# EAGLE design bi-n-tic-kscgs (EAGLE 6.6.0)
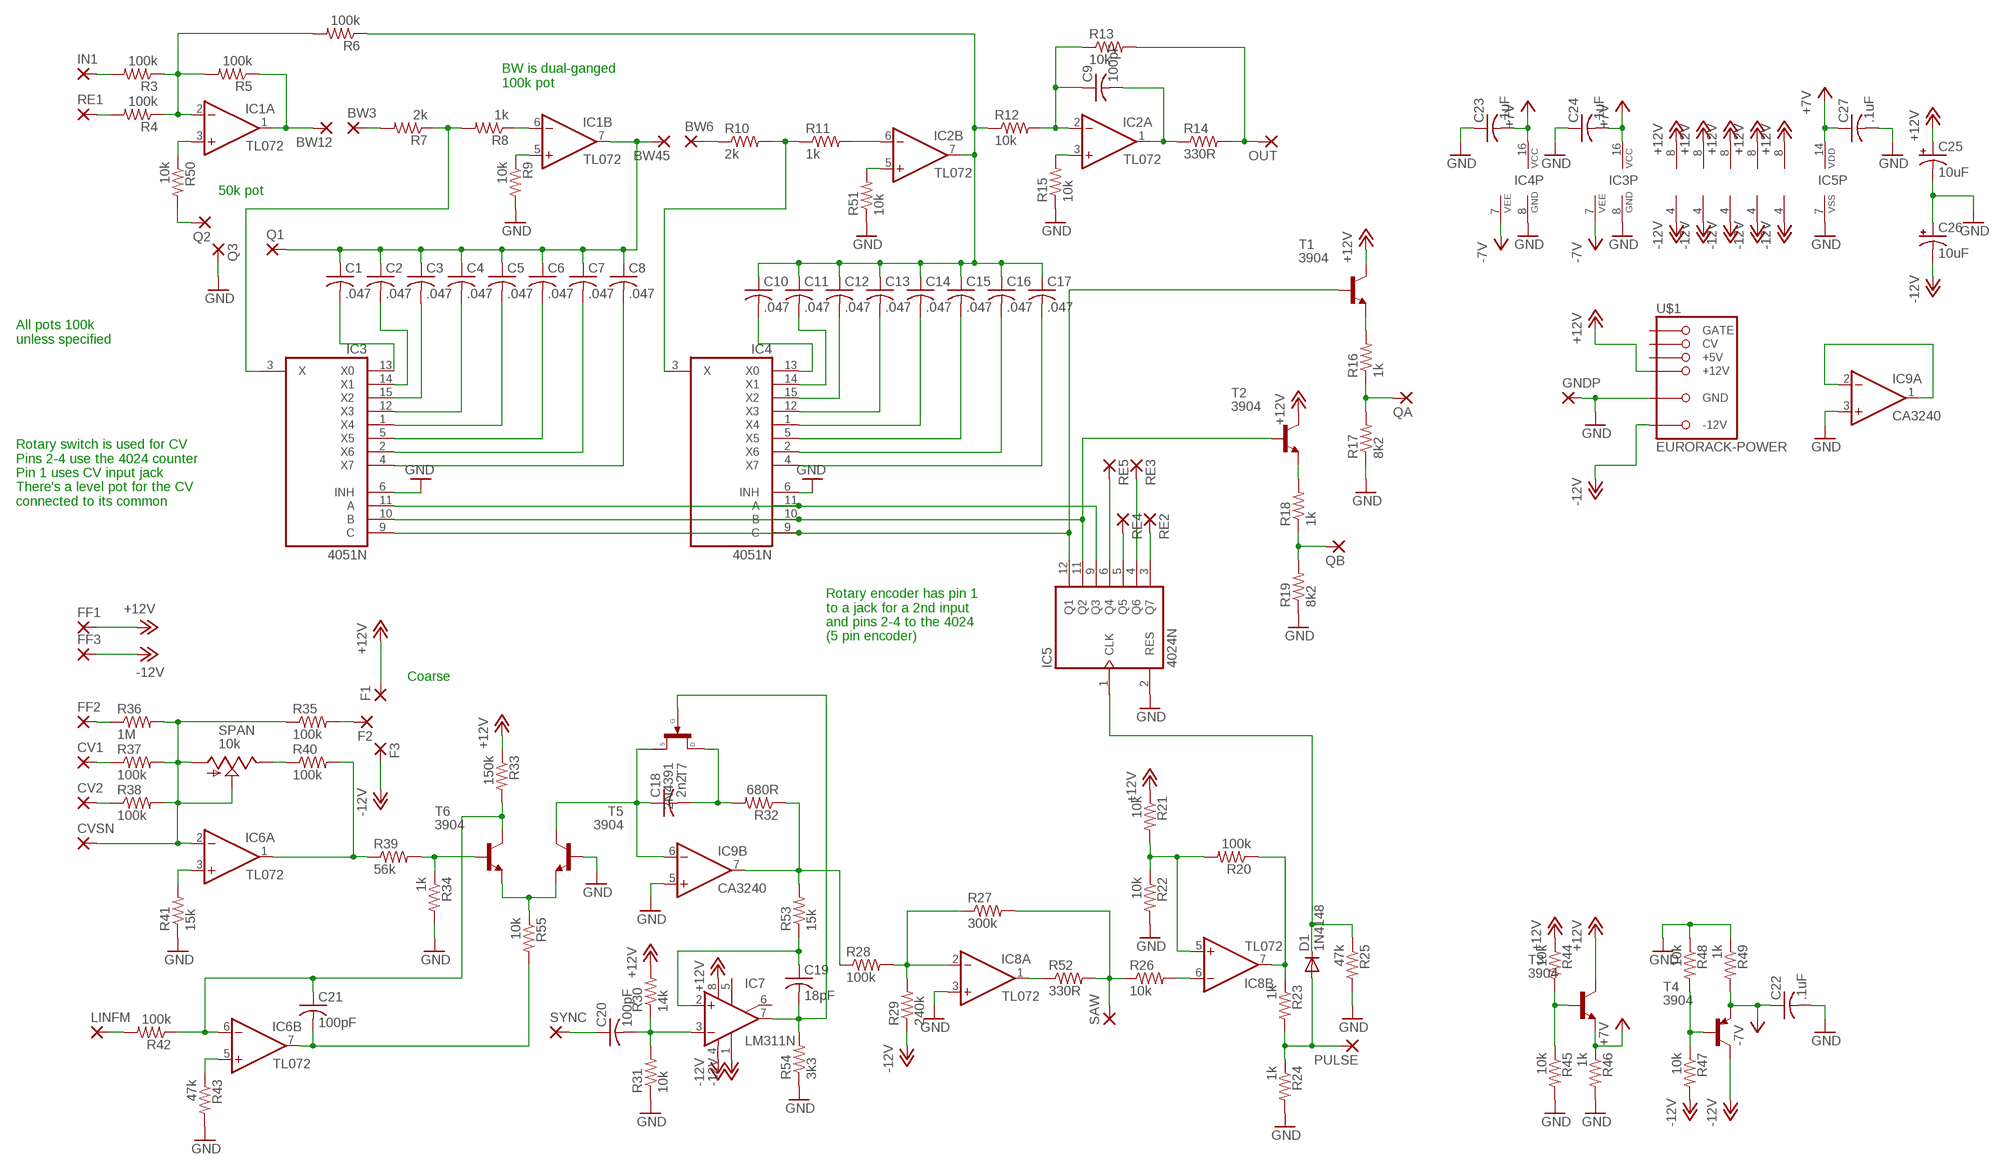
[diagram p0: schematic, sheet 1]

## Parts
BW3  2,54/1,0  [2,54/1,0]
BW6  2,54/1,0  [2,54/1,0]
BW12  2,54/1,0  [2,54/1,0]
BW45  2,54/1,0  [2,54/1,0]
C1  .047  C-US050-025X075  [C050-025X075]
C2  .047  C-US050-025X075  [C050-025X075]
C3  .047  C-US050-025X075  [C050-025X075]
C4  .047  C-US050-025X075  [C050-025X075]
C5  .047  C-US050-025X075  [C050-025X075]
C6  .047  C-US050-025X075  [C050-025X075]
C7  .047  C-US050-025X075  [C050-025X075]
C8  .047  C-US050-025X075  [C050-025X075]
C9  100pF  C-US050-025X075  [C050-025X075]
C10  .047  C-US050-025X075  [C050-025X075]
C11  .047  C-US050-025X075  [C050-025X075]
C12  .047  C-US050-025X075  [C050-025X075]
C13  .047  C-US050-025X075  [C050-025X075]
C14  .047  C-US050-025X075  [C050-025X075]
C15  .047  C-US050-025X075  [C050-025X075]
C16  .047  C-US050-025X075  [C050-025X075]
C17  .047  C-US050-025X075  [C050-025X075]
C18  2n2  C-US050-025X075  [C050-025X075]
C19  18pF  C-US050-025X075  [C050-025X075]
C20  100pF  C-US050-025X075  [C050-025X075]
C21  100pF  C-US050-025X075  [C050-025X075]
C22  .1uF  C-US050-025X075  [C050-025X075]
C23  .1uF  C-US050-025X075  [C050-025X075]
C24  .1uF  C-US050-025X075  [C050-025X075]
C25  10uF  CPOL-USE2.5-5  [E2,5-5]
C26  10uF  CPOL-USE2.5-5  [E2,5-5]
C27  .1uF  C-US050-025X075  [C050-025X075]
CV1  2,54/1,0  [2,54/1,0]
CV2  2,54/1,0  [2,54/1,0]
CVSN  2,54/1,0  [2,54/1,0]
D1  1N4148  1N4148DO35-7  [DO35-7]
F1  2,54/1,0  [2,54/1,0]
F2  2,54/1,0  [2,54/1,0]
F3  2,54/1,0  [2,54/1,0]
FF1  2,54/1,0  [2,54/1,0]
FF2  2,54/1,0  [2,54/1,0]
FF3  2,54/1,0  [2,54/1,0]
GNDP  2,54/1,0  [2,54/1,0]
IC1  TL072  TL072-TOPP  [DIL08]
IC2  TL072  TL072-TOPP  [DIL08]
IC3  4051N  [DIL16]
IC4  4051N  [DIL16]
IC5  4024N  [DIL14]
IC6  TL072  TL072-TOPP  [DIL08]
IC7  LM311N  [DIL08]
IC8  TL072  TL072-TOPP  [DIL08]
IC9  CA3240  TL072-TOPP  [DIL08]
IN1  2,54/1,0  [2,54/1,0]
LINFM  2,54/1,0  [2,54/1,0]
OUT  2,54/1,0  [2,54/1,0]
PULSE  2,54/1,0  [2,54/1,0]
Q1  2,54/1,0  [2,54/1,0]
Q2  2,54/1,0  [2,54/1,0]
Q3  2,54/1,0  [2,54/1,0]
QA  2,54/1,0  [2,54/1,0]
QB  2,54/1,0  [2,54/1,0]
R3  100k  R-US_0207/10  [0207/10]
R4  100k  R-US_0207/10  [0207/10]
R5  100k  R-US_0207/10  [0207/10]
R6  100k  R-US_0207/10  [0207/10]
R7  2k  R-US_0207/10  [0207/10]
R8  1k  R-US_0207/10  [0207/10]
R9  10k  R-US_0207/10  [0207/10]
R10  2k  R-US_0207/10  [0207/10]
R11  1k  R-US_0207/10  [0207/10]
R12  10k  R-US_0207/10  [0207/10]
R13  10k  R-US_0207/10  [0207/10]
R14  330R  R-US_0207/10  [0207/10]
R15  10k  R-US_0207/10  [0207/10]
R16  1k  R-US_0207/10  [0207/10]
R17  8k2  R-US_0207/10  [0207/10]
R18  1k  R-US_0207/10  [0207/10]
R19  8k2  R-US_0207/10  [0207/10]
R20  100k  R-US_0207/10  [0207/10]
R21  10k  R-US_0207/10  [0207/10]
R22  10k  R-US_0207/10  [0207/10]
R23  1k  R-US_0207/10  [0207/10]
R24  1k  R-US_0207/10  [0207/10]
R25  47k  R-US_0207/10  [0207/10]
R26  10k  R-US_0207/10  [0207/10]
R27  300k  R-US_0207/10  [0207/10]
R28  100k  R-US_0207/10  [0207/10]
R29  240k  R-US_0207/10  [0207/10]
R30  14k  R-US_0207/10  [0207/10]
R31  10k  R-US_0207/10  [0207/10]
R32  680R  R-US_0207/10  [0207/10]
R33  150k  R-US_0207/10  [0207/10]
R34  1k  R-US_0207/10  [0207/10]
R35  100k  R-US_0207/10  [0207/10]
R36  1M  R-US_0207/10  [0207/10]
R37  100k  R-US_0207/10  [0207/10]
R38  100k  R-US_0207/10  [0207/10]
R39  56k  R-US_0207/10  [0207/10]
R40  100k  R-US_0207/10  [0207/10]
R41  15k  R-US_0207/10  [0207/10]
R42  100k  R-US_0207/10  [0207/10]
R43  47k  R-US_0207/10  [0207/10]
R44  10k  R-US_0207/10  [0207/10]
R45  10k  R-US_0207/10  [0207/10]
R46  1k  R-US_0207/10  [0207/10]
R47  10k  R-US_0207/10  [0207/10]
R48  10k  R-US_0207/10  [0207/10]
R49  1k  R-US_0207/10  [0207/10]
R50  10k  R-US_0207/10  [0207/10]
R51  10k  R-US_0207/10  [0207/10]
R52  330R  R-US_0207/10  [0207/10]
R53  15k  R-US_0207/10  [0207/10]
R54  3k3  R-US_0207/10  [0207/10]
R55  10k  R-US_0207/10  [0207/10]
RE1  2,54/1,0  [2,54/1,0]
RE2  2,54/1,0  [2,54/1,0]
RE3  2,54/1,0  [2,54/1,0]
RE4  2,54/1,0  [2,54/1,0]
RE5  2,54/1,0  [2,54/1,0]
SAW  2,54/1,0  [2,54/1,0]
SPAN  10k  TRIM_US-RJ9W  [RJ9W]
SYNC  2,54/1,0  [2,54/1,0]
T1  3904  2N3904-NPN-TO92-EBC  [TO92-EBC]
T2  3904  2N3904-NPN-TO92-EBC  [TO92-EBC]
T3  3904  2N3904-NPN-TO92-EBC  [TO92-EBC]
T4  3904  2N3906-PNP-TO92-EBC  [TO92-EBC]
T5  3904  2N3904-NPN-TO92-EBC  [TO92-EBC]
T6  3904  2N3904-NPN-TO92-EBC  [TO92-EBC]
T7  2N4391  [TO18E]
U$1  EURORACK-POWER  [PINSHRD_PTH_2X8]

## Nets
+7V: C23.2 C24.2 C27.1 IC3.16(VCC) IC4.16(VCC) IC5.14(VDD) R46.1 T3.E
+12V: C25.+ F1.1(P) FF1.1(P) IC1.8(P:V+) IC2.8(P:V+) IC6.8(P:V+) IC7.8(V+) IC8.8(P:V+) IC9.8(P:V+) R21.1 R30.2 R33.1 R44.1 T1.C T2.C T3.C U$1.+12V@1(+12V) U$1.+12V@2(+12V)
-7V: C22.1 IC3.7(VEE) IC4.7(VEE) R49.2 T4.E
-12V: C26.- F3.1(P) FF3.1(P) IC1.4(P:V-) IC2.4(P:V-) IC6.4(P:V-) IC7.1(GND) IC7.4(V-) IC8.4(P:V-) IC9.4(P:V-) R29.1 R47.2 T4.C U$1.-12V@1(-12V) U$1.-12V@2(-12V)
GND: C22.2 C23.1 C24.1 C25.- C26.+ C27.2 GNDP.1(P) IC3.6(INH) IC3.8(GND) IC4.6(INH) IC4.8(GND) IC5.2(RES) IC5.7(VSS) IC8.3(A:+IN) IC9.3(A:+IN) IC9.5(B:+IN) Q3.1(P) R9.2 R15.1 R17.1 R19.1 R22.2 R24.2 R25.2 R31.1 R34.2 R41.1 R43.2 R45.2 R46.2 R48.1 R49.1 R51.1 R54.1 T5.B U$1.GND@1(GND) U$1.GND@2(GND) U$1.GND@3(GND) U$1.GND@4(GND) U$1.GND@5(GND) U$1.GND@6(GND)
N$1: IC8.2(A:-IN) R27.1 R28.2 R29.2
N$2: IC1.2(A:-IN) R3.1 R4.1 R5.2 R6.2
N$3: BW12.1(P) IC1.1(A:OUT) R5.1
N$4: IC1.3(A:+IN) R50.1
N$5: Q2.1(P) R50.2
N$6: BW3.1(P) R7.2
N$7: IC3.3(X) R7.1 R8.2
N$8: IC1.6(B:-IN) R8.1
N$9: C1.2 IC3.13(X0)
N$10: C2.2 IC3.14(X1)
N$11: C3.2 IC3.15(X2)
N$12: C4.2 IC3.12(X3)
N$13: C5.2 IC3.1(X4)
N$14: C6.2 IC3.5(X5)
N$15: C7.2 IC3.2(X6)
N$16: C8.2 IC3.4(X7)
N$17: BW45.1(P) C1.1 C2.1 C3.1 C4.1 C5.1 C6.1 C7.1 C8.1 IC1.7(B:OUT) Q1.1(P)
N$18: BW6.1(P) R10.1
N$19: IC4.3(X) R10.2 R11.1
N$20: IC2.6(B:-IN) R11.2
N$21: C10.1 C11.1 C12.1 C13.1 C14.1 C15.1 C16.1 C17.1 IC2.7(B:OUT) R6.1 R12.1
N$22: C9.1 IC2.2(A:-IN) R12.2 R13.1
N$23: C9.2 IC2.1(A:OUT) R14.1
N$24: OUT.1(P) R13.2 R14.2
N$25: IC2.3(A:+IN) R15.2
N$26: IC1.5(B:+IN) R9.1
N$27: C10.2 IC4.13(X0)
N$28: C11.2 IC4.14(X1)
N$29: C12.2 IC4.15(X2)
N$30: C13.2 IC4.12(X3)
N$31: C14.2 IC4.1(X4)
N$32: C15.2 IC4.5(X5)
N$33: C16.2 IC4.2(X6)
N$34: C17.2 IC4.4(X7)
N$35: IC2.5(B:+IN) R51.2
N$36: R16.2 T1.E
N$37: FF2.1(P) R36.1
N$38: CV1.1(P) R37.1
N$39: CV2.1(P) R38.1
N$40: LINFM.1(P) R42.2
N$41: QA.1(P) R16.1 R17.2
N$42: IC3.10(B) IC4.10(B) IC5.11(Q2) T2.B
N$43: IC3.9(C) IC4.9(C) IC5.12(Q1) T1.B
N$44: IC3.11(A) IC4.11(A) IC5.9(Q3)
N$45: R18.2 T2.E
N$46: QB.1(P) R18.1 R19.2
N$47: D1.C IC5.1(CLK) R25.1
N$48: IC9.7(B:OUT) R28.1 R32.1 R53.2
N$49: IC8.5(B:+IN) R20.2 R21.2 R22.1
N$50: IC8.7(B:OUT) R20.1 R23.1
N$51: D1.A PULSE.1(P) R23.2 R24.1
N$52: IC8.6(B:-IN) R26.2
N$53: R26.1 R27.2 R52.2 SAW.1(P)
N$54: IC8.1(A:OUT) R52.1
N$55: C19.2 IC7.7(OUT) R54.2 T7.G
N$56: C18.1 IC9.6(B:-IN) T5.C T7.S
N$57: C18.2 R32.2 T7.D
N$58: C19.1 IC7.2(+IN) R53.1
N$59: C20.2 IC7.3(-IN) R30.1 R31.2
N$60: C20.1 SYNC.1(P)
N$61: IC9.1(A:OUT) IC9.2(A:-IN)
N$62: IC6.5(B:+IN) R43.1
N$63: C21.2 IC6.7(B:OUT) R55.2
N$64: C21.1 IC6.6(B:-IN) R33.2 R42.1 T6.C
N$65: IC6.3(A:+IN) R41.2
N$66: R44.2 R45.1 T3.B
N$67: CVSN.1(P) IC6.2(A:-IN) R35.1 R36.2 R37.2 R38.2 SPAN.A SPAN.S
N$68: R40.1 SPAN.E
N$69: IC6.1(A:OUT) R39.1 R40.2
N$70: F2.1(P) R35.2
N$71: R34.1 R39.2 T6.B
N$72: IN1.1(P) R3.2
N$73: R55.1 T5.E T6.E
N$74: R47.1 R48.2 T4.B
N$75: R4.2 RE1.1(P)
N$76: IC5.6(Q4) RE5.1(P)
N$77: IC5.5(Q5) RE4.1(P)
N$79: IC5.3(Q7) RE2.1(P)
RE3: IC5.4(Q6) RE3.1(P)
Unconnected: IC7.5(ON) IC7.6(ON/STR) U$1.+5V@1(+5V) U$1.+5V@2(+5V) U$1.CV@1(CV) U$1.CV@2(CV) U$1.GATE@1(GATE) U$1.GATE@2(GATE)

## Notes on the sheet
- BW is dual-ganged
  100k pot
- 50k pot
- All pots 100k
  unless specified
- Rotary switch is used for CV
  Pins 2-4 use the 4024 counter
  Pin 1 uses CV input jack
  There's a level pot for the CV
  connected to its common
- Rotary encoder has pin 1
  to a jack for a 2nd input
  and pins 2-4 to the 4024
  (5 pin encoder)
- Coarse

## Library data of the parts
BW3 BW6 BW12 BW45 CV1 CV2 CVSN F1-F3 FF1-FF3 GNDP IN1 LINFM OUT PULSE Q1-Q3 QA QB RE1-RE5 SAW SYNC = wirepad:2,54/1,0: THROUGH-HOLE PAD
C1-C24 C27 = rcl:C-US: CAPACITOR, American symbol
C25 C26 = rcl:CPOL-US: POLARIZED CAPACITOR, American symbol
D1 = diode:1N4148: DIODE high speed (Philips)
IC1 IC2 IC6 IC8 IC9 = mmoretti:TL072-TOP: OP AMP
IC3 IC4 = 40xx:4051: 8-channel ANALOG MULTIPLEXER
IC5 = 40xx:4024: 7-stage binary/ripple COUNTER
IC7 = linear:LM311: COMPARATOR
R3-R55 = rcl:R-US_: RESISTOR, American symbol
SPAN = pot:TRIM_US-: POTENTIOMETER
T1-T3 T5 T6 = transistor-neu-to92:*-NPN-: NPN Transistror
T4 = transistor-neu-to92:*-PNP-: PNP Transistror
T7 = mmoretti:2N4391: N-CHANNEL FET
U$1 = mmoretti:EURORACK-POWER

## Board
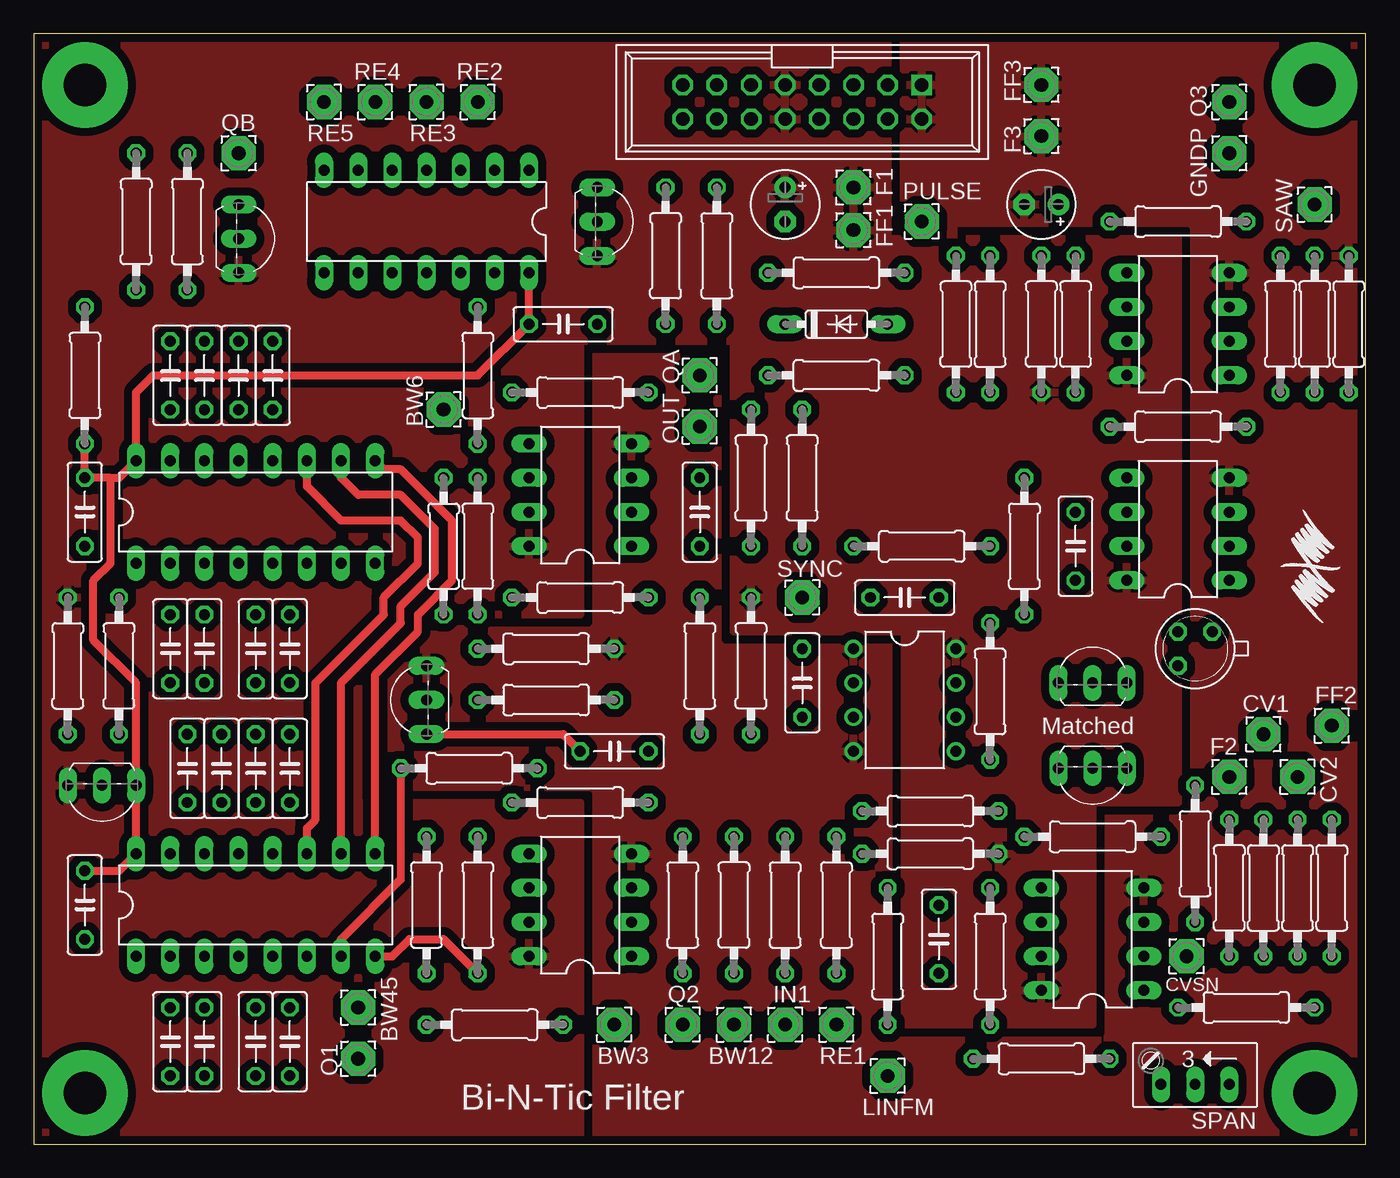
[diagram p1: board, top side]
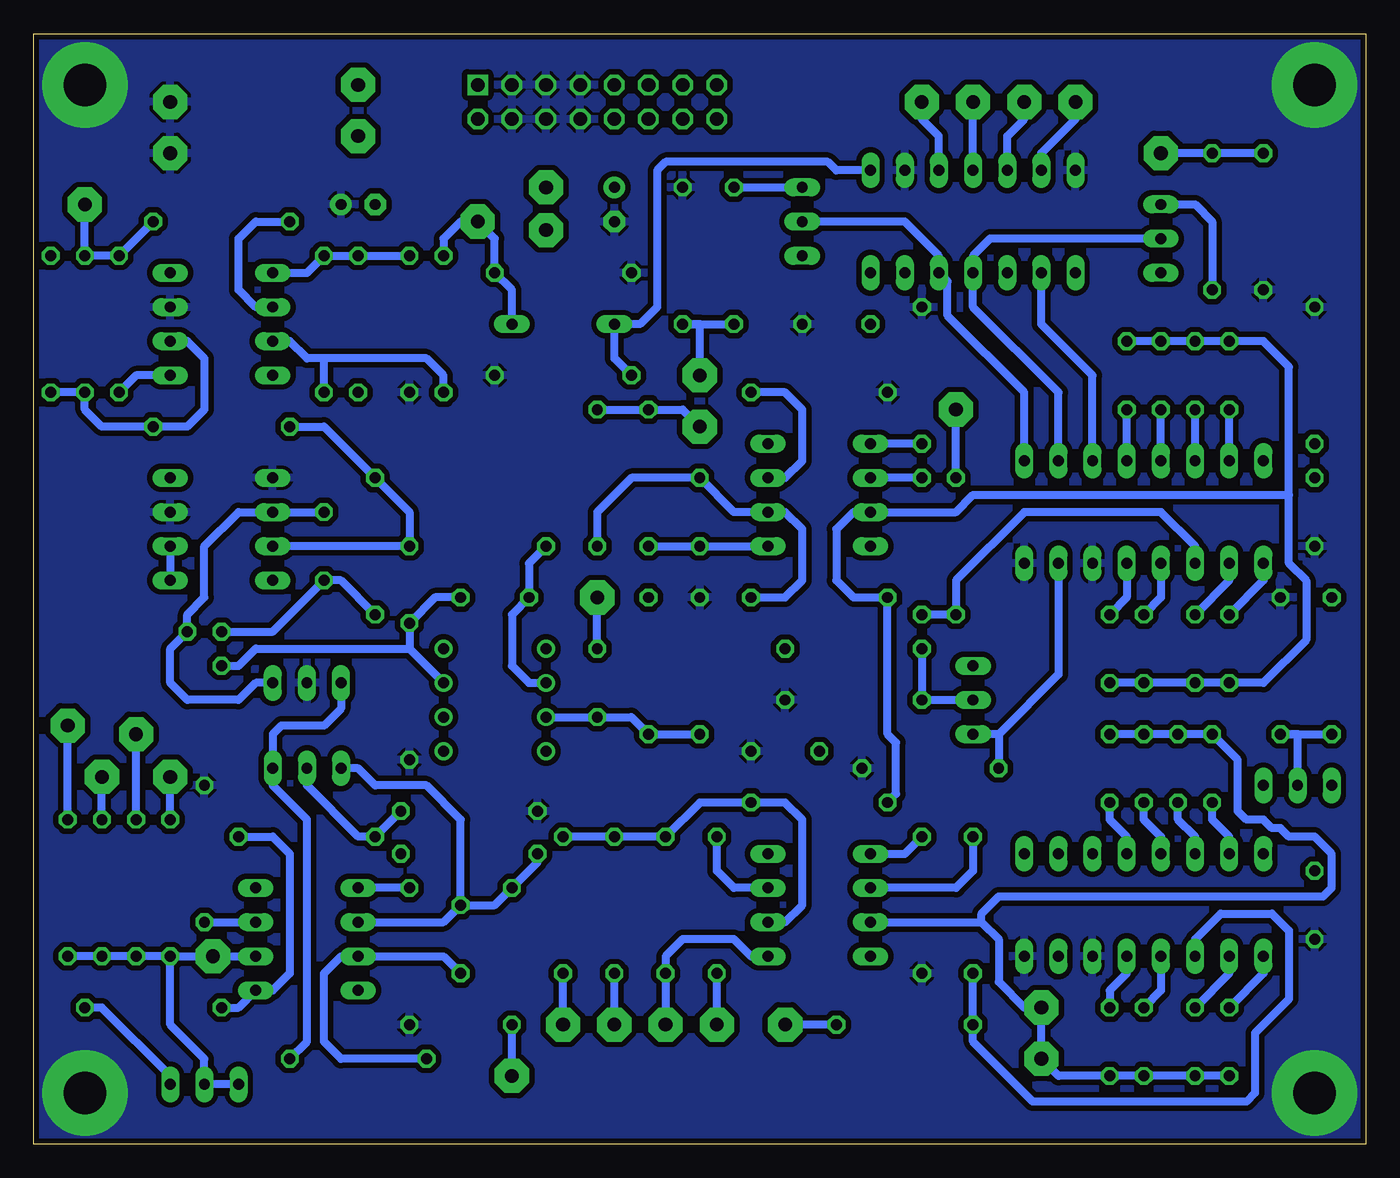
[diagram p2: board, bottom side, seen from below]

Size 99.06 x 82.55 mm. Coordinates in mm from the lower left corner, seen from the top.
Outline: 99.06,0 99.06,82.55 0,82.55 0,0 99.06,0
Copper layers (1*16): Top 0.035mm / dielectric 1.5mm / Bottom 0.035mm
Design rules "SeeedStudio_2layer_DRU_no_angle_20140221": minimum track width 6mil, minimum drill 12mil, track to track 6mil, track to pad 6mil, pad to pad 6mil, via to via 6mil, smd to smd 0mil, copper to edge 10mil, drill to drill 10mil, minimum pad ring 10mil, minimum via ring 6mil, stop-mask expansion 2mil, vias tented up to drill 100mil, thermal gap 10mil

### Footprints (pad centres in the part's own frame; a part is rotated, then mirrored left to right if it is on the bottom)
2,54/1,0 = drill 1.016 pad 2.54 octagon: 1 0,0
C050-025X075 = drill 0.813 octagon: 1 -2.54,0; 2 2.54,0
E2,5-5 = drill 0.813 pad 1.6: + -1.27,0 | drill 0.813 pad 1.6 octagon: - 1.27,0
DO35-7 = drill 0.813 long: A 3.81,0; C -3.81,0
DIL08 = drill 0.813 long: 1 -3.81,-3.81; 2 -1.27,-3.81; 3 1.27,-3.81; 4 3.81,-3.81; 5 3.81,3.81; 6 1.27,3.81; 7 -1.27,3.81; 8 -3.81,3.81
DIL16 = drill 0.813 long: 1 -8.89,-3.81; 2 -6.35,-3.81; 3 -3.81,-3.81; 4 -1.27,-3.81; 5 1.27,-3.81; 6 3.81,-3.81; 7 6.35,-3.81; 8 8.89,-3.81; 9 8.89,3.81; 10 6.35,3.81; 11 3.81,3.81; 12 1.27,3.81; 13 -1.27,3.81; 14 -3.81,3.81; 15 -6.35,3.81; 16 -8.89,3.81
DIL14 = drill 0.813 long: 1 -7.62,-3.81; 2 -5.08,-3.81; 3 -2.54,-3.81; 4 0,-3.81; 5 2.54,-3.81; 6 5.08,-3.81; 7 7.62,-3.81; 8 7.62,3.81; 9 5.08,3.81; 10 2.54,3.81; 11 0,3.81; 12 -2.54,3.81; 13 -5.08,3.81; 14 -7.62,3.81
DIL08' = drill 0.813 pad 1.27: 1 -3.81,-3.81; 2 -1.27,-3.81; 3 1.27,-3.81; 4 3.81,-3.81; 5 3.81,3.81; 6 1.27,3.81; 7 -1.27,3.81; 8 -3.81,3.81
0207/10 = drill 0.813 octagon: 1 -5.08,0; 2 5.08,0
RJ9W = drill 0.813 long: A 2.54,0.635; E -2.54,0.635; S 0,0.635
TO92-EBC = drill 0.813 long: B 0,-1.27; C 2.54,-1.27; E -2.54,-1.27
TO18E = drill 0.813 octagon: D 1.27,-1.27; G 1.27,1.27; S -1.27,-1.27
PINSHRD_PTH_2X8 = drill 1.016 octagon: +5V@1 3.81,1.27; +5V@2 3.81,-1.27; +12V@1 1.27,1.27; +12V@2 1.27,-1.27; -12V@1 -8.89,1.27; CV@1 6.35,1.27; CV@2 6.35,-1.27; GATE@1 8.89,1.27; GATE@2 8.89,-1.27; GND@1 -6.35,1.27; GND@2 -6.35,-1.27; GND@3 -3.81,1.27; GND@4 -3.81,-1.27; GND@5 -1.27,1.27; GND@6 -1.27,-1.27 | drill 1.016 square: -12V@2 -8.89,-1.27

### Placement (x,y rotation side)
BW3  43.18,8.89 90 top
BW6  30.48,54.61 90 top
BW12  52.07,8.89 90 top
BW45  24.13,10.16 90 top
C1  16.51,27.94 270 top
C2  13.97,27.94 270 top
C3  11.43,27.94 270 top
C4  19.05,27.94 270 top
C5  10.16,7.62 90 top
C6  19.05,7.62 90 top
C7  12.7,7.62 90 top
C8  16.51,7.62 90 top
C9  49.53,46.99 270 top
C10  15.24,57.15 270 top
C11  12.7,57.15 270 top
C12  10.16,57.15 270 top
C13  17.78,57.15 270 top
C14  10.16,36.83 90 top
C15  19.05,36.83 90 top
C16  12.7,36.83 90 top
C17  16.51,36.83 90 top
C18  77.47,44.45 270 top
C19  64.77,40.64 0 top
C20  57.15,34.29 270 top
C21  67.31,15.24 270 top
C22  43.18,29.21 0 top
C23  3.81,46.99 90 top
C24  3.81,17.78 90 top
C25  55.88,69.85 270 top
C26  74.93,69.85 180 top
C27  39.37,60.96 0 top
CV1  91.44,30.48 90 top
CV2  93.98,27.3 90 top
CVSN  85.72,13.97 90 top
D1  59.69,60.96 0 top
F1  60.96,71.12 90 top
F2  88.9,27.3 90 top
F3  74.93,74.93 90 top
FF1  60.96,67.94 90 top
FF2  96.52,31.11 90 top
FF3  74.93,78.74 90 top
GNDP  88.9,73.66 90 top
IC1  40.64,17.78 90 top
IC2  40.64,48.26 90 top
IC3  16.51,17.78 0 top
IC4  16.51,46.99 0 top
IC5  29.21,68.58 180 top
IC6  78.74,15.24 90 top
IC7  LM311N  [DIL08']  64.77,33.02 270 top
IC8  85.09,60.96 90 top
IC9  85.09,45.72 90 top
IN1  55.88,8.89 90 top
LINFM  63.5,5.08 90 top
OUT  49.53,53.34 90 top
PULSE  66.04,68.58 90 top
Q1  24.13,6.35 90 top
Q2  48.26,8.89 90 top
Q3  88.9,77.47 90 top
QA  49.53,57.15 90 top
QB  15.24,73.66 90 top
R3  55.88,17.78 270 top
R4  59.69,17.78 270 top
R5  52.07,17.78 90 top
R6  40.64,25.4 0 top
R7  34.29,8.89 0 top
R8  29.21,17.78 270 top
R9  33.02,17.78 270 top
R10  30.48,44.45 270 top
R11  33.02,44.45 90 top
R12  40.64,40.64 0 top
R13  57.15,49.53 90 top
R14  53.34,49.53 90 top
R15  40.64,55.88 0 top
R16  46.99,66.04 90 top
R17  50.8,66.04 270 top
R18  11.43,68.58 270 top
R19  7.62,68.58 90 top
R20  77.47,60.96 90 top
R21  74.93,60.96 90 top
R22  71.12,60.96 270 top
R23  68.58,60.96 90 top
R24  59.69,64.77 180 top
R25  59.69,57.15 0 top
R26  85.09,68.58 180 top
R27  95.25,60.96 90 top
R28  85.09,53.34 0 top
R29  97.79,60.96 270 top
R30  53.34,35.56 90 top
R31  49.53,35.56 270 top
R32  73.66,44.45 270 top
R33  66.67,21.59 180 top
R34  66.67,24.77 180 top
R35  88.9,19.05 90 top
R36  96.52,19.05 270 top
R37  91.44,19.05 270 top
R38  93.98,19.05 270 top
R39  78.74,22.86 180 top
R40  90.17,10.16 180 top
R41  86.36,21.59 270 top
R42  63.5,13.97 270 top
R43  71.12,13.97 270 top
R44  2.54,35.56 270 top
R45  6.35,35.56 90 top
R46  3.81,57.15 90 top
R47  38.1,36.83 0 top
R48  38.1,33.02 180 top
R49  32.38,27.94 180 top
R50  48.26,17.78 270 top
R51  33.02,57.15 270 top
R52  92.71,60.96 90 top
R53  66.04,44.45 0 top
R54  71.12,33.66 90 top
R55  74.93,6.35 180 top
RE1  59.69,8.89 90 top
RE2  33.02,77.47 90 top
RE3  29.21,77.47 90 top
RE4  25.4,77.47 90 top
RE5  21.59,77.47 90 top
SAW  95.25,69.85 90 top
SPAN  86.36,5.08 180 top
SYNC  57.15,40.64 270 top
T1  43.18,68.58 270 top
T2  16.51,67.31 270 top
T3  5.08,25.4 180 top
T4  27.94,33.02 90 top
T5  78.74,35.56 0 top
T6  78.74,26.67 180 top
T7  86.36,36.83 180 top
U$1  57.15,77.47 180 top

### Tracks (layer width: path | path; a pad name or v marks a point on that pad's centre or on a via)
+7V
  Top 0.61: C24.2 6.35,20.32 IC3.16 T3.E 7.62,34.29 4.45,37.47 4.45,41.91 5.71,43.18 5.71,49.53 | 5.71,49.53 C23.2 R46.1 | 5.71,49.53 6.35,49.53 IC4.16 7.62,55.88 8.89,57.15 33.02,57.15 C27.1 IC5.14
+12V
  pour Top (isolate 0.61): 0,82.55 63.5,82.55 63.5,67.31 85.09,67.31 85.09,25.4 78.74,25.4 78.74,10.16 78.74,8.89 64.77,8.89 64.77,38.1 52.07,38.1 52.07,59.69 40.64,59.69 40.64,39.37 24.13,39.37 24.13,25.4 40.64,25.4 40.64,0 0,0
-7V
  Top 0.61: T4.E 39.37,30.48 C22.1 | R49.2 27.3,19.68 22.86,15.24 IC3.7
  Bottom 0.61: IC4.7 22.86,34.92 27.3,30.48 | 27.3,30.48 R49.2 | 27.3,30.48 T4.E
-12V
  pour Top (isolate 0.61, rank 2): 40.64,0 99.06,0 99.06,82.55 63.5,82.55 63.5,67.31 85.09,67.31 85.09,25.4 78.74,25.4 78.74,8.89 64.77,8.89 64.77,38.1 52.07,38.1 52.07,59.69 40.64,59.69 40.64,39.37 24.13,39.37 24.13,25.4 40.64,25.4
GND  (via drill 3.17 pad 6.35)
  Top 0.61: IC3.8 26.67,13.97 27.94,15.24 30.48,15.24 R9.2
  other vias: 3.81,3.81 95.25,3.81 95.25,78.74 3.81,78.74
  pour Bottom (isolate 0.406): 0,82.55 99.06,82.55 99.06,0 0,0
N$1
  Bottom 0.61: IC8.2 87.63,59.69 86.36,58.42 86.36,54.61 87.63,53.34 R28.2 93.98,53.34 95.25,54.61 R27.1 R29.2
N$2
  Bottom 0.61: IC1.2 43.18,16.51 41.91,17.78 41.91,24.13 43.18,25.4 R6.2 49.53,25.4 R5.2 R3.1 R4.1
N$3
  Bottom 0.61: IC1.1 45.72,13.97 46.99,15.24 50.8,15.24 52.07,13.97 R5.1 BW12.1
N$4
  Bottom 0.61: IC1.3 46.99,19.05 48.26,20.32 R50.1
N$5
  Bottom 0.61: Q2.1 R50.2
N$6
  Bottom 0.61: R7.2 BW3.1
N$7
  Bottom 0.61: R8.2 R7.1 29.21,7.62 24.77,3.17 8.89,3.17 8.26,3.81 8.26,8.26 5.71,10.79 5.71,15.88 6.99,17.14 10.79,17.14 12.7,15.24 IC3.3
N$8
  Bottom 0.61: R8.1 29.21,20.32 30.48,19.05 IC1.6
N$9
  Bottom 0.61: IC3.13 15.24,22.86 16.51,24.13 C1.2
N$10
  Bottom 0.61: IC3.14 12.7,22.86 13.97,24.13 C2.2
N$11
  Bottom 0.61: IC3.15 10.16,22.86 11.43,24.13 C3.2
N$12
  Bottom 0.61: IC3.12 17.78,22.86 19.05,24.13 C4.2
N$13
  Bottom 0.61: IC3.1 7.62,12.7 C5.2
N$14
  Bottom 0.61: IC3.5 17.78,12.7 19.05,11.43 C6.2
N$15
  Bottom 0.61: IC3.2 10.16,12.7 C7.2
N$16
  Bottom 0.61: IC3.4 15.24,11.43 C8.2
N$17
  Bottom 0.61: C5.1 C7.1 C8.1 C6.1 22.86,5.08 Q1.1 BW45.1 25.4,10.16 27.3,12.06 27.3,15.24 28.57,16.51 | IC1.7 28.57,16.51 | 28.57,16.51 28.57,17.14 27.3,18.41 3.17,18.41 2.54,19.05 2.54,21.59 3.81,22.86 5.71,22.86 6.35,23.5 6.99,23.5 7.62,24.13 8.89,24.13 9.53,24.77 9.53,28.57 C3.1 C2.1 C1.1 C4.1
N$18
  Bottom 0.61: R10.1 BW6.1
N$19
  Bottom 0.61: IC4.3 12.7,44.45 15.24,46.99 25.4,46.99 30.48,41.91 R10.2 R11.1
N$20
  Bottom 0.61: R11.2 IC2.6
N$21
  Bottom 0.61: R6.1 34.92,26.04 34.92,29.84 35.56,30.48 R12.1 38.1,40.64 39.37,41.91 39.37,45.72 38.1,46.99 IC2.7 30.48,46.99 29.21,48.26 5.71,48.26 | 5.71,48.26 5.71,43.18 4.45,41.91 4.45,37.47 7.62,34.29 C14.1 C16.1 C17.1 C15.1 | 5.71,48.26 5.71,57.78 7.62,59.69 C12.1 C11.1 C10.1 C13.1
N$22
  Bottom 0.61: R13.1 57.15,46.99 54.61,49.53 C9.1 46.99,46.99 IC2.2 43.18,46.99 41.91,45.72 41.91,41.91 43.18,40.64 R12.2
N$23
  Bottom 0.61: R14.1 C9.2 IC2.1
N$24
  Bottom 0.61: R13.2 R14.2 50.8,54.61 OUT.1
N$25
  Bottom 0.61: IC2.3 43.18,49.53 41.91,50.8 41.91,54.61 43.18,55.88 R15.2
N$26
  Bottom 0.61: IC1.5 34.29,21.59 R9.1
N$27
  Bottom 0.61: IC4.13 C10.2
N$28
  Bottom 0.61: IC4.14 C11.2
N$29
  Bottom 0.61: IC4.15 C12.2
N$30
  Bottom 0.61: IC4.12 C13.2
N$31
  Bottom 0.61: IC4.1 7.62,41.91 C14.2
N$32
  Bottom 0.61: IC4.5 17.78,40.64 C15.2
N$33
  Bottom 0.61: IC4.2 10.16,41.91 C16.2
N$34
  Bottom 0.61: IC4.4 15.24,40.64 C17.2
N$35
  Bottom 0.61: R51.2 IC2.5
N$36
  Bottom 0.61: R16.2 T1.E
N$37
  Bottom 0.61: R36.1 FF2.1
N$38
  Bottom 0.61: R37.1 CV1.1
N$39
  Bottom 0.61: R38.1 CV2.1
N$40
  Bottom 0.61: LINFM.1 R42.2
N$41
  Bottom 0.61: QA.1 49.53,60.96 R17.2 R16.1
N$42
  Top 0.61: IC3.10 22.86,34.29 27.3,38.73 27.3,40.01 29.84,42.55 29.84,45.72 27.3,48.26 24.13,48.26 22.86,49.53 IC4.10
  Bottom 0.61: IC4.10 22.86,55.88 29.21,62.23 IC5.11 29.21,66.04 27.94,67.31 T2.B
N$43
  Top 0.61: IC3.9 25.4,34.92 28.57,38.1 28.57,39.37 31.11,41.91 31.11,46.35 27.3,50.16 26.04,50.16 IC4.9
  Bottom 0.61: IC4.9 25.4,55.88 31.11,61.59 31.11,64.14 IC5.12 31.75,66.04 34.29,68.58 T1.B
N$44
  Top 0.61: IC3.11 20.32,23.5 20.95,24.13 20.95,34.29 26.04,39.37 26.04,40.64 28.57,43.18 28.57,45.09 27.3,46.35 22.86,46.35 20.32,48.9 IC4.11
  Bottom 0.61: IC4.11 20.32,57.15 24.13,60.96 IC5.9
N$45
  Bottom 0.61: T2.E 12.7,69.85 11.43,68.58 R18.2
N$46
  Bottom 0.61: R19.2 R18.1 QB.1
N$47
  Bottom 0.61: IC5.1 39.37,72.39 40.01,73.03 52.07,73.03 52.7,72.39 52.7,62.23 53.98,60.96 D1.C 55.88,58.42 R25.1
N$48
  Bottom 0.61: R28.1 77.47,53.34 R32.1 71.12,46.99 R53.2 IC9.7
N$49
  Bottom 0.61: IC8.5 78.74,64.77 R20.2 R21.2 R22.1
N$50
  Bottom 0.61: R23.1 68.58,57.15 69.85,58.42 77.47,58.42 | 77.47,58.42 78.74,58.42 80.01,59.69 IC8.7 | R20.1 77.47,58.42
N$51
  Bottom 0.61: D1.A 63.5,63.5 R24.1 64.77,67.31 PULSE.1 67.31,68.58 68.58,67.31 R23.2
N$52
  Bottom 0.61: IC8.6 82.55,62.23 83.82,63.5 83.82,67.31 82.55,68.58 R26.2
N$53
  Bottom 0.61: R26.1 R52.2 R27.2 SAW.1
N$54
  Bottom 0.61: IC8.1 91.44,57.15 R52.1
N$55
  Bottom 0.61: T7.G 83.82,35.56 82.55,36.83 71.12,36.83 | 71.12,36.83 IC7.7 | C19.2 69.22,40.64 R54.2 71.12,36.83
N$56
  Bottom 0.61: T5.C 82.55,34.29 83.82,33.02 87.63,33.02 88.9,34.29 88.9,36.83 T7.S 87.63,39.37 86.36,40.64 86.36,44.45 83.82,46.99 IC9.6 C18.1
N$57
  Bottom 0.61: T7.D 81.28,38.1 C18.2 76.2,41.91 R32.2
N$58
  Bottom 0.61: R53.1 62.23,43.18 C19.1 63.5,39.37 63.5,35.56 62.23,34.29 IC7.2
N$59
  Bottom 0.61: IC7.3 C20.2 54.61,31.75 R30.1 R31.2
N$60
  Bottom 0.61: C20.1 SYNC.1
N$61
  Bottom 0.61: IC9.2 IC9.1
N$62
  Bottom 0.61: R43.1 IC6.5
N$63
  Bottom 0.61: C21.2 68.58,13.97 IC6.7 76.2,13.97 77.47,12.7 77.47,7.62 76.2,6.35 R55.2
N$64
  Bottom 0.61: R33.2 61.59,20.95 R42.1 64.77,17.78 C21.1 | IC6.6 68.58,16.51 C21.1 | C21.1 67.31,24.13 69.85,26.67 73.66,26.67 74.93,27.94 T6.C
N$65
  Bottom 0.61: R41.2 IC6.3
N$66
  Bottom 0.61: T3.B 5.08,30.48 R45.1 R44.2
N$67
  Bottom 0.61: SPAN.A SPAN.S 86.36,6.35 88.9,8.89 R35.1 | R35.1 R37.2 R38.2 R36.2 | R35.1 CVSN.1 IC6.2
N$68
  Bottom 0.61: R40.1 93.98,10.16 88.9,5.08 SPAN.E
N$69
  Bottom 0.61: R40.2 83.82,10.16 IC6.1 81.28,11.43 80.01,12.7 80.01,21.59 81.28,22.86 R39.1
N$70
  Bottom 0.61: R35.2 F2.1
N$71
  Bottom 0.61: R34.1 R39.2 74.93,22.86 78.74,26.67 T6.B
N$72
  Bottom 0.61: IN1.1 R3.2
N$73
  Bottom 0.61: R55.1 78.74,7.62 78.74,24.13 81.28,26.67 T6.E 81.28,30.48 80.64,31.11 77.47,31.11 76.2,32.38 T5.E
N$74
  Bottom 0.61: R47.1 R48.2 T4.B
N$75
  Bottom 0.61: RE1.1 R4.2
N$76
  Bottom 0.61: IC5.6 24.13,73.66 21.59,76.2 RE5.1
N$77
  Bottom 0.61: IC5.5 26.67,74.93 25.4,76.2 RE4.1
N$79
  Bottom 0.61: IC5.3 31.75,74.93 33.02,76.2 RE2.1
RE3
  Bottom 0.61: IC5.4 RE3.1

### Text on the board
tPlace: Bi-N-Tic Filter
tNames: Matched